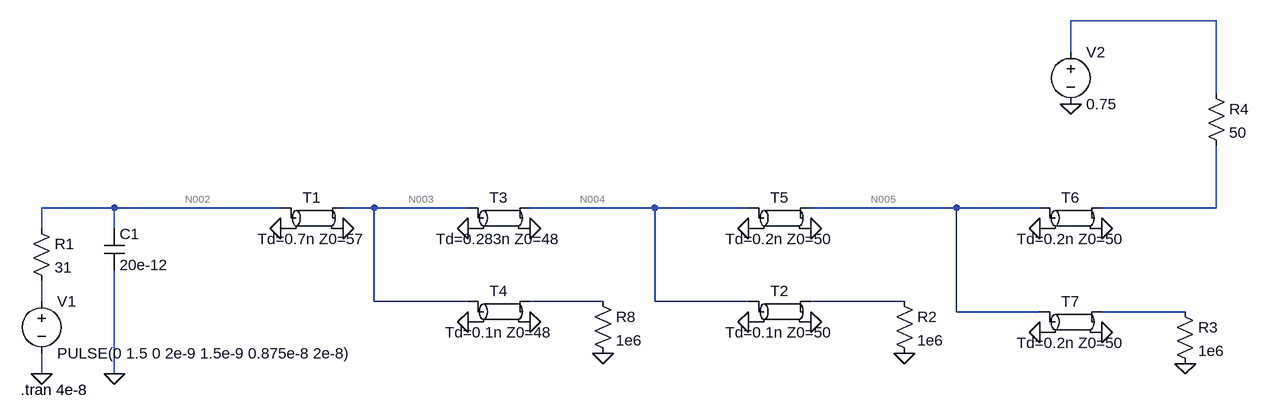
[diagram p0: schematic DaisyChain.asc]
DaisyChain.asc, the LTspice schematic file:
Version 4
SHEET 1 1784 680
WIRE 1728 -272 1504 -272
WIRE 1504 -224 1504 -272
WIRE 1728 -160 1728 -272
WIRE 32 16 -80 16
WIRE 288 16 32 16
WIRE 432 16 384 16
WIRE 576 16 432 16
WIRE 864 16 672 16
WIRE 1008 16 864 16
WIRE 1328 16 1104 16
WIRE 1456 16 1328 16
WIRE 1728 16 1728 -80
WIRE 1728 16 1552 16
WIRE -80 48 -80 16
WIRE 32 48 32 16
WIRE -80 160 -80 128
WIRE 432 160 432 16
WIRE 576 160 432 160
WIRE 784 160 672 160
WIRE 864 160 864 16
WIRE 1008 160 864 160
WIRE 1248 160 1104 160
WIRE 1328 176 1328 16
WIRE 1456 176 1328 176
WIRE 1680 176 1552 176
WIRE -80 272 -80 240
WIRE 32 272 32 112
FLAG -80 272 0
FLAG 32 272 0
FLAG 576 48 0
FLAG 672 48 0
FLAG 576 192 0
FLAG 672 192 0
FLAG 288 48 0
FLAG 384 48 0
FLAG 784 240 0
FLAG 1008 192 0
FLAG 1104 192 0
FLAG 1248 240 0
FLAG 1456 48 0
FLAG 1552 48 0
FLAG 1456 208 0
FLAG 1552 208 0
FLAG 1680 256 0
FLAG 1504 -144 0
FLAG 1008 48 0
FLAG 1104 48 0
SYMBOL voltage -80 144 R0
WINDOW 123 0 0 Left 0
WINDOW 39 0 0 Left 0
SYMATTR InstName V1
SYMATTR Value PULSE(0 1.5 0 2e-9 1.5e-9 0.875e-8 2e-8)
SYMBOL res -96 32 R0
SYMATTR InstName R1
SYMATTR Value 31
SYMBOL cap 16 48 R0
SYMATTR InstName C1
SYMATTR Value 20e-12
SYMBOL tline 336 32 R0
SYMATTR InstName T1
SYMATTR Value Td=0.7n Z0=57
SYMBOL tline 624 32 R0
SYMATTR InstName T3
SYMATTR Value Td=0.283n Z0=48
SYMBOL tline 624 176 R0
SYMATTR InstName T4
SYMATTR Value Td=0.1n Z0=48
SYMBOL res 768 144 R0
SYMATTR InstName R8
SYMATTR Value 1e6
SYMBOL tline 1056 176 R0
SYMATTR InstName T2
SYMATTR Value Td=0.1n Z0=50
SYMBOL res 1232 144 R0
SYMATTR InstName R2
SYMATTR Value 1e6
SYMBOL tline 1056 32 R0
SYMATTR InstName T5
SYMATTR Value Td=0.2n Z0=50
SYMBOL tline 1504 32 R0
SYMATTR InstName T6
SYMATTR Value Td=0.2n Z0=50
SYMBOL tline 1504 192 R0
SYMATTR InstName T7
SYMATTR Value Td=0.2n Z0=50
SYMBOL res 1664 160 R0
SYMATTR InstName R3
SYMATTR Value 1e6
SYMBOL voltage 1504 -240 R0
WINDOW 123 0 0 Left 0
WINDOW 39 0 0 Left 0
SYMATTR InstName V2
SYMATTR Value 0.75
SYMBOL res 1712 -176 R0
SYMATTR InstName R4
SYMATTR Value 50
TEXT -112 296 Left 2 !.tran 4e-8

The netlist it stands for:
* DaisyChain.asc
V1 N007 0 PULSE(0 1.5 0 2e-9 1.5e-9 0.875e-8 2e-8)
R1 N002 N007 31
C1 N002 0 20e-12
T1 N002 0 N003 0 Td=0.7n Z0=57
T3 N003 0 N004 0 Td=0.283n Z0=48
T4 N003 0 N008 0 Td=0.1n Z0=48
R8 N008 0 1e6
T2 N004 0 N009 0 Td=0.1n Z0=50
R2 N009 0 1e6
T5 N004 0 N005 0 Td=0.2n Z0=50
T6 N005 0 N006 0 Td=0.2n Z0=50
T7 N005 0 N010 0 Td=0.2n Z0=50
R3 N010 0 1e6
V2 N001 0 0.75
R4 N001 N006 50
.tran 4e-8
.backanno
.end

* Results of the author's LTspice run, read from the files saved beside the schematic
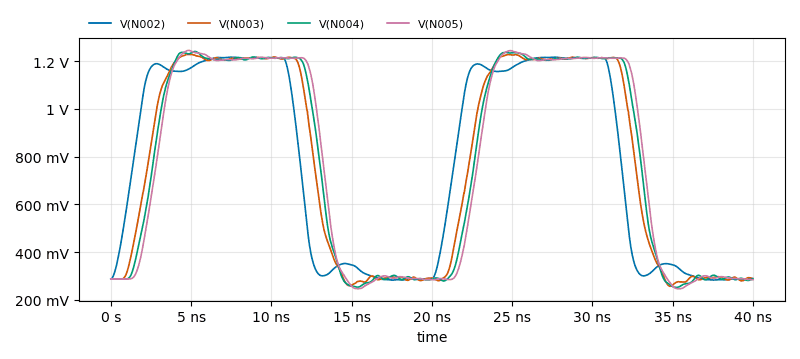
[diagram p1: Transient Analysis of DaisyChain.asc, plotted from the saved traces]
* Transient Analysis, 1 run:
*   V(N002): min 282.5 mV, max 1.217 V, average 773.1 mV, rms 878.5 mV, last 288.3 mV
*   V(N003): min 256.7 mV, max 1.229 V, average 773.2 mV, rms 880.9 mV, last 288.7 mV
*   V(N004): min 251.6 mV, max 1.24 V, average 773.1 mV, rms 883.7 mV, last 288.4 mV
*   V(N005): min 246 mV, max 1.245 V, average 773.1 mV, rms 885.3 mV, last 284.2 mV